# Altium schematic sheet Memory.SchDoc
size A4; SheetNumber: 3; SheetTotal: 4
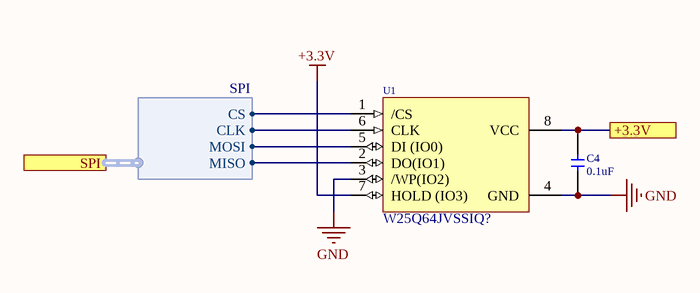
[diagram p0: Memory.SchDoc]

## Parts
C4  value 0.1uF  [CERCAP 0402]
U1  W25Q64JVSSIQ?  [SO-8]

## Ports
+3.3V, SPI (harness SPI)

## Harnesses
SPI: CS, CLK, MOSI, MISO

## Nets
+3.3V: U1.7(HOLD_(IO3))
GND: C4.1 U1.3(/WP(IO2)) U1.4(GND)
+3.3V: C4.2 U1.8(VCC) ; port +3.3V  [a separate net that carries the same name]
NetU1_1: U1.1(/CS) ; port SPI.CS
NetU1_2: U1.2(DO(IO1)) ; port SPI.MISO
NetU1_5: U1.5(DI_(IO0)) ; port SPI.MOSI
NetU1_6: U1.6(CLK) ; port SPI.CLK

## Library data of the parts
C4 = !Capacitor: Capacitor; IsSMT: NoSMT; Diel: X7R; Voltage: *
U1 = Flash